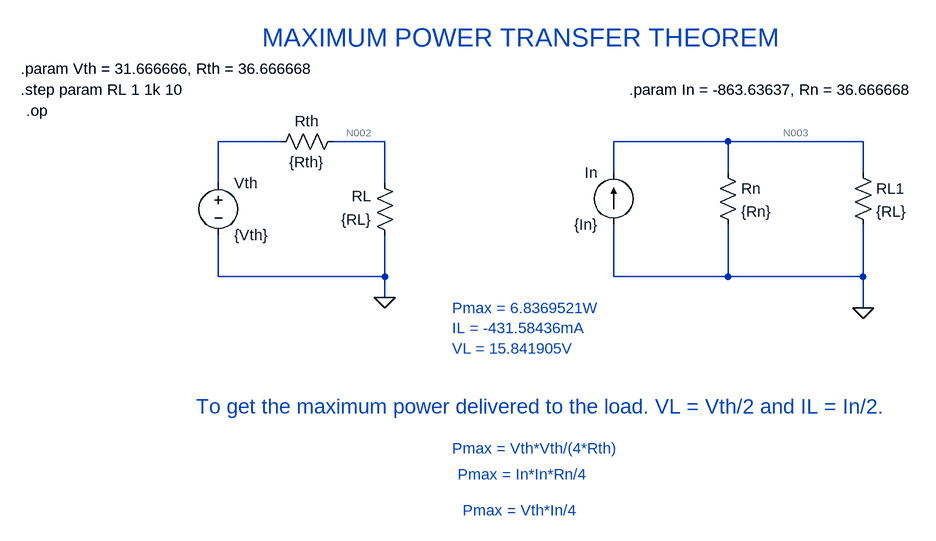
[diagram p0: schematic Maximum_Power_Transfer_Theorem_1.asc]
Maximum_Power_Transfer_Theorem_1.asc, the LTspice schematic file:
Version 4
SHEET 1 1468 680
WIRE -64 -112 -160 -112
WIRE 96 -112 16 -112
WIRE 624 -112 448 -112
WIRE 832 -112 624 -112
WIRE 448 -64 448 -112
WIRE 624 -64 624 -112
WIRE 832 -64 832 -112
WIRE -160 -48 -160 -112
WIRE 96 -48 96 -112
WIRE -160 96 -160 32
WIRE 96 96 96 32
WIRE 96 96 -160 96
WIRE 448 96 448 16
WIRE 624 96 624 16
WIRE 624 96 448 96
WIRE 832 96 832 16
WIRE 832 96 624 96
WIRE 96 128 96 96
WIRE 832 144 832 96
FLAG 96 128 0
FLAG 832 144 0
SYMBOL voltage -160 -64 R0
SYMATTR InstName Vth
SYMATTR Value {Vth}
SYMBOL res 32 -128 R90
WINDOW 0 0 56 VBottom 2
WINDOW 3 32 56 VTop 2
SYMATTR InstName Rth
SYMATTR Value {Rth}
SYMBOL res 112 48 R180
WINDOW 0 36 76 Left 2
WINDOW 3 36 40 Left 2
SYMATTR InstName RL
SYMATTR Value {RL}
SYMBOL current 448 16 R180
WINDOW 0 24 80 Left 2
WINDOW 3 24 0 Left 2
SYMATTR InstName In
SYMATTR Value {In}
SYMBOL res 608 -80 R0
SYMATTR InstName Rn
SYMATTR Value {Rn}
SYMBOL res 816 -80 R0
SYMATTR InstName RL1
SYMATTR Value {RL}
TEXT 304 -272 Center 4 ;MAXIMUM POWER TRANSFER THEOREM
TEXT -464 -224 Left 2 !.param Vth = 31.666666, Rth = 36.666668
TEXT -464 -192 Left 2 !.step param RL 1 1k 10
TEXT -456 -160 Left 2 !.op
TEXT 200 144 Left 2 ;Pmax = 6.8369521W\nIL = -431.58436mA\nVL = 15.841905V
TEXT 472 -192 Left 2 !.param In = -863.63637, Rn = 36.666668
TEXT 336 296 Center 3 ;To get the maximum power delivered to the load. VL = Vth/2 and IL = In/2.
TEXT 200 360 Left 2 ;Pmax = Vth*Vth/(4*Rth)
TEXT 208 400 Left 2 ;Pmax = In*In*Rn/4
TEXT 216 456 Left 2 ;Pmax = Vth*In/4

The netlist it stands for:
* Maximum_Power_Transfer_Theorem_1.asc
Vth N001 0 {Vth}
Rth N002 N001 {Rth}
RL 0 N002 {RL}
In 0 N003 {In}
Rn N003 0 {Rn}
RL1 N003 0 {RL}
* MAXIMUM POWER TRANSFER THEOREM
.param Vth = 31.666666, Rth = 36.666668
.step param RL 1 1k 10
.op
* Pmax = 6.8369521W
* IL = -431.58436mA
* VL = 15.841905V
.param In = -863.63637, Rn = 36.666668
* To get the maximum power delivered to the load. VL = Vth/2 and IL = In/2.
* Pmax = Vth*Vth/(4*Rth)
* Pmax = In*In*Rn/4
* Pmax = Vth*In/4
.backanno
.end

* Results of the author's LTspice run, read from the files saved beside the schematic
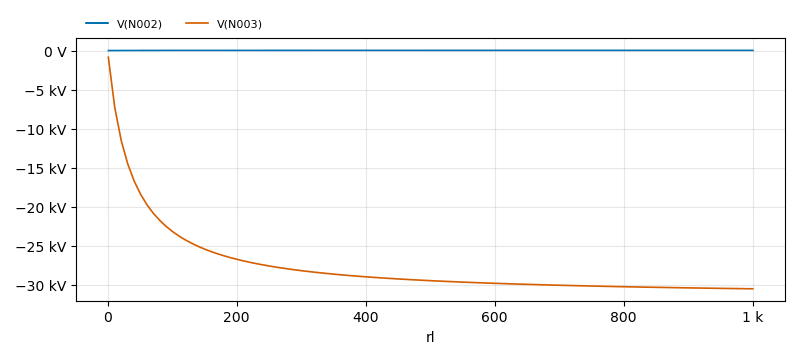
[diagram p1: Operating Point of Maximum_Power_Transfer_Theorem_1.asc, plotted from the saved traces]
* Operating Point, 1 run:
*   V(N002): 840.7 mV at rl=1 , 30.55 V at rl=1 k, min 840.7 mV, max 30.55 V
*   V(N003): -840.7 V at rl=1 , -30.55 kV at rl=1 k, min -30.55 kV, max -840.7 V